# EAGLE design Tempus (EAGLE 7.7.0)
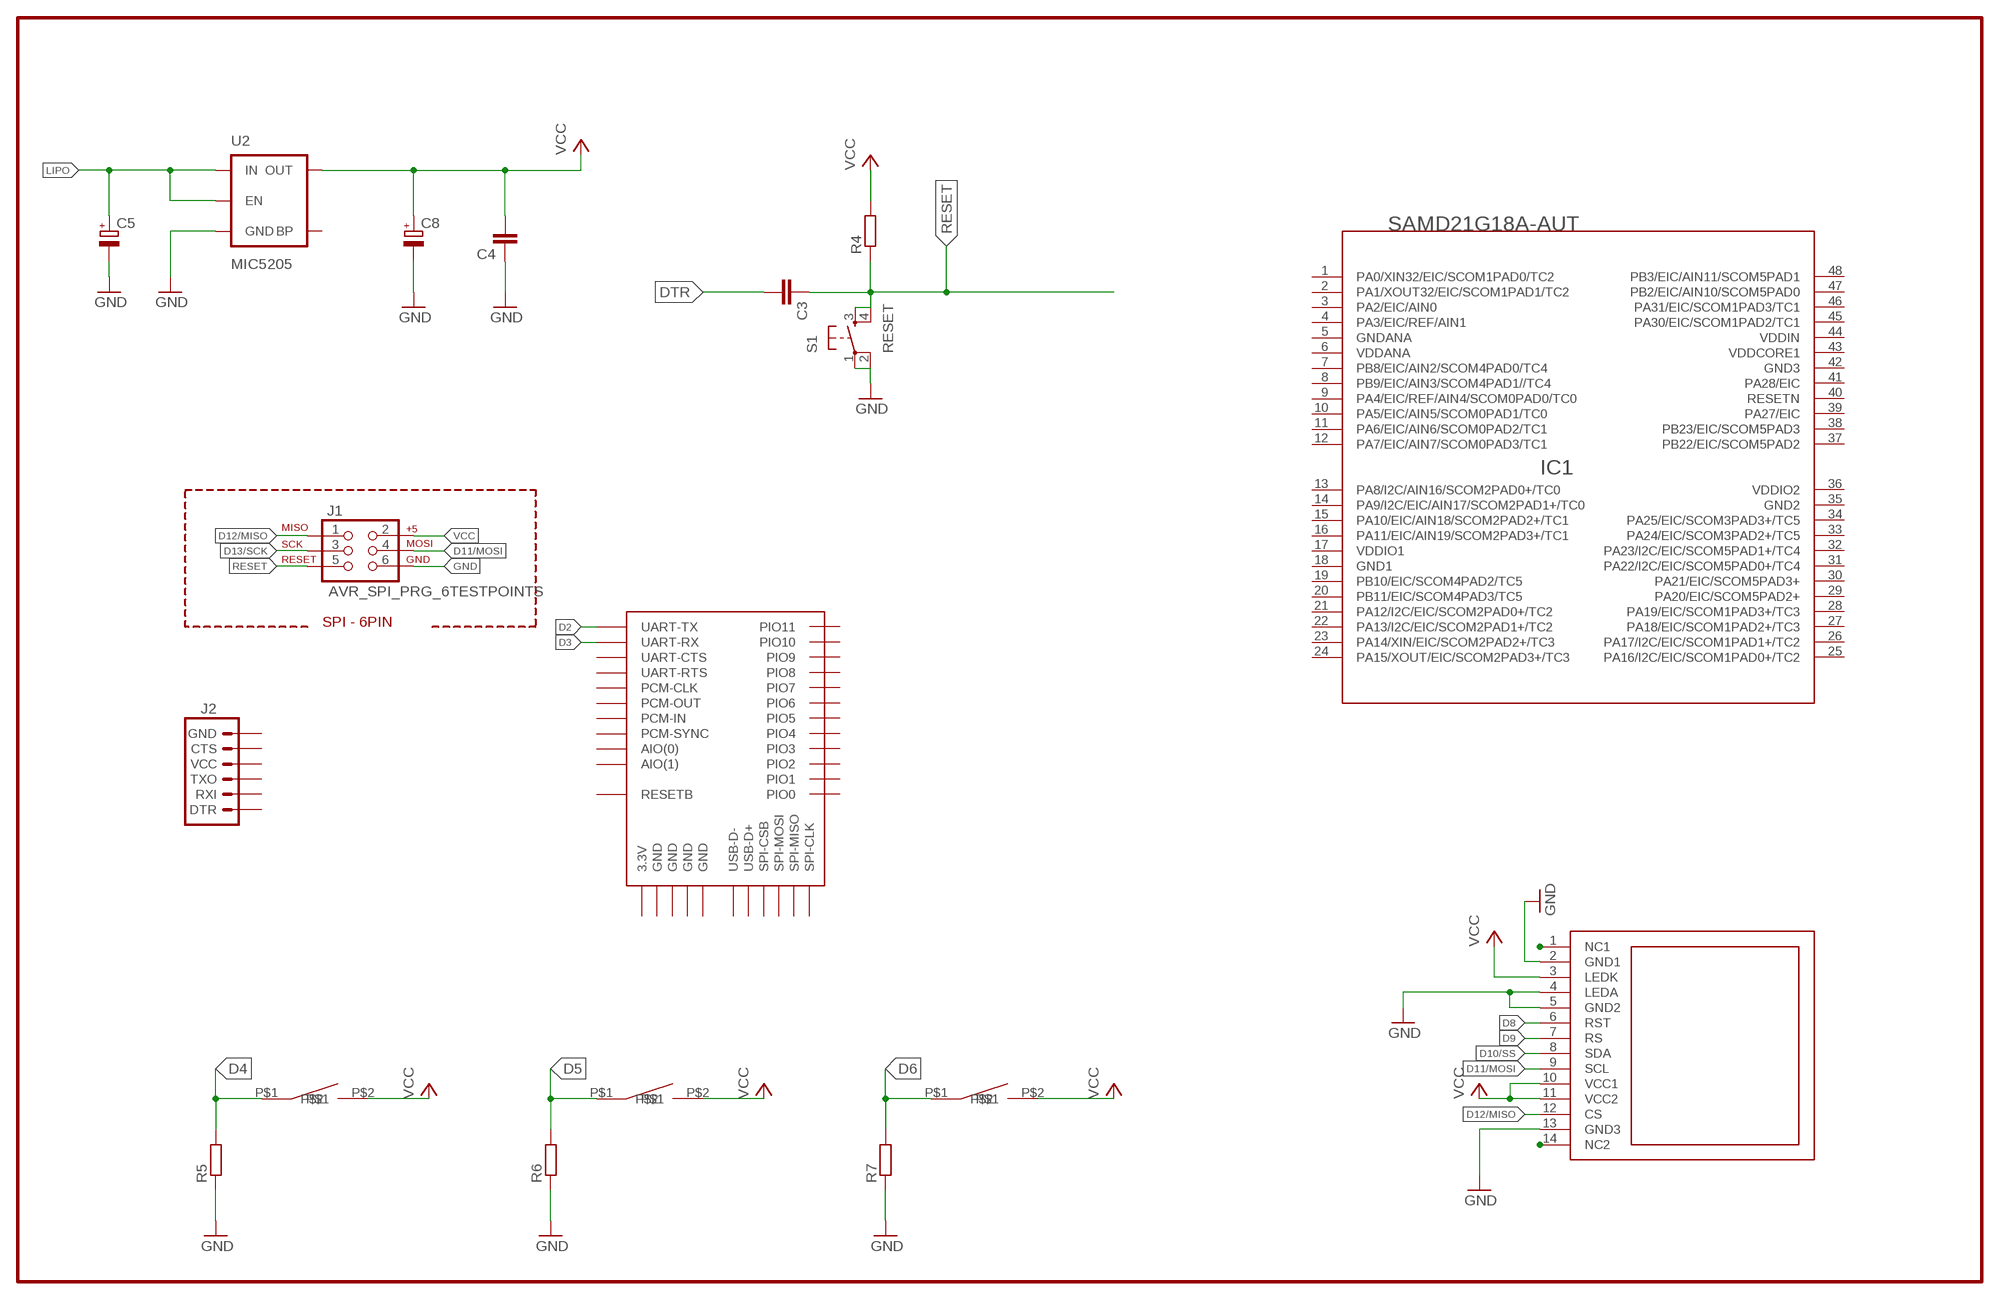
[diagram p0: schematic, sheet 1]

## Parts
C3  C-EUC1608  [C1608]
C4  C-EUC1608  [C1608]
C5  CPOL-EUA/3216-18R  [A/3216-18R]
C8  CPOL-EUA/3216-18R  [A/3216-18R]
IC1  SAMD21G18A-AUT  1792_SAMD21G18A-AUT  [TQFP48-7X7]
J1  AVR_SPI_PRG_6TESTPOINTS  [2X3_TEST_POINTS]
J2  ARDUINO_SERIAL_PROGRAMPTH  [1X06]
R4  R-EU_R0603  [R0603]
R5  R-EU_R0603  [R0603]
R6  R-EU_R0603  [R0603]
R7  R-EU_R0603  [R0603]
S1  RESET  TAC_SWITCHSMD  [TACTILE-SWITCH-SMD]
U2  MIC5205  MIC52055V  [SOT23-5]
U$1  DISP_TFT18  [TFT18]
U$2  MICRO_SIDE_TACT_BUTTON_SMD_SECURE  [MICRO_SIDE_TACT_BUTTON_SMD_SECURE]
U$3  MICRO_SIDE_TACT_BUTTON_SMD_SECURE  [MICRO_SIDE_TACT_BUTTON_SMD_SECURE]
U$4  MICRO_SIDE_TACT_BUTTON_SMD_SECURE  [MICRO_SIDE_TACT_BUTTON_SMD_SECURE]
U$5  BTM400_6B  [BTM400_6B]

## Nets
D2: U$5.UART-TX
D3: U$5.UART-RX
D4: R5.2 U$4.P$1
D5: R6.2 U$2.P$1
D6: R7.2 U$3.P$1
D8: U$1.6(RST)
D9: U$1.7(RS)
D10/SS: U$1.8(SDA)
D11/MOSI: J1.4 U$1.9(SCL)
D12/MISO: J1.1 U$1.12(CS)
D13/SCK: J1.3
DTR: C3.2
GND: C4.1 C5.- C8.- J1.6 R5.1 R6.1 R7.1 S1.1 S1.2 U2.2(GND) U$1.2(GND1) U$1.4(LEDA) U$1.5(GND2) U$1.13(GND3)
LIPO: C5.+ U2.1(IN) U2.3(EN)
N$11: U$1.1(NC1)
N$12: U$1.14(NC2)
RESET: C3.1 J1.5 R4.1 S1.3 S1.4
VCC: C4.2 C8.+ J1.2 R4.2 U2.5(OUT) U$1.3(LEDK) U$1.10(VCC1) U$1.11(VCC2) U$2.P$2 U$3.P$2 U$4.P$2
Unconnected: IC1.1(PA0/XIN32/EIC/SCOM1PAD0/TC2) IC1.2(PA1/XOUT32/EIC/SCOM1PAD1/TC2) IC1.3(PA2/EIC/AIN0) IC1.4(PA3/EIC/REF/AIN1) IC1.7(PB8/EIC/AIN2/SCOM4PAD0/TC4) IC1.8(PB9/EIC/AIN3/SCOM4PAD1//TC4) IC1.9(PA4/EIC/REF/AIN4/SCOM0PAD0/TC0) IC1.10(PA5/EIC/AIN5/SCOM0PAD1/TC0) IC1.11(PA6/EIC/AIN6/SCOM0PAD2/TC1) IC1.12(PA7/EIC/AIN7/SCOM0PAD3/TC1) IC1.13(PA8/I2C/AIN16/SCOM2PAD0+/TC0) IC1.14(PA9/I2C/EIC/AIN17/SCOM2PAD1+/TC0) IC1.15(PA10/EIC/AIN18/SCOM2PAD2+/TC1) IC1.16(PA11/EIC/AIN19/SCOM2PAD3+/TC1) IC1.19(PB10/EIC/SCOM4PAD2/TC5) IC1.20(PB11/EIC/SCOM4PAD3/TC5) IC1.21(PA12/I2C/EIC/SCOM2PAD0+/TC2) IC1.22(PA13/I2C/EIC/SCOM2PAD1+/TC2) IC1.23(PA14/XIN/EIC/SCOM2PAD2+/TC3) IC1.24(PA15/XOUT/EIC/SCOM2PAD3+/TC3) IC1.25(PA16/I2C/EIC/SCOM1PAD0+/TC2) IC1.26(PA17/I2C/EIC/SCOM1PAD1+/TC2) IC1.27(PA18/EIC/SCOM1PAD2+/TC3) IC1.28(PA19/EIC/SCOM1PAD3+/TC3) IC1.29(PA20/EIC/SCOM5PAD2+) IC1.30(PA21/EIC/SCOM5PAD3+) IC1.31(PA22/I2C/EIC/SCOM5PAD0+/TC4) IC1.32(PA23/I2C/EIC/SCOM5PAD1+/TC4) IC1.33(PA24/EIC/SCOM3PAD2+/TC5) IC1.34(PA25/EIC/SCOM3PAD3+/TC5) IC1.37(PB22/EIC/SCOM5PAD2) IC1.38(PB23/EIC/SCOM5PAD3) IC1.39(PA27/EIC) IC1.40(RESETN) IC1.41(PA28/EIC) IC1.43(VDDCORE1) IC1.45(PA30/EIC/SCOM1PAD2/TC1) IC1.46(PA31/EIC/SCOM1PAD3/TC1) IC1.47(PB2/EIC/AIN10/SCOM5PAD0) IC1.48(PB3/EIC/AIN11/SCOM5PAD1) J2.1(DTR) J2.2(RXI) J2.3(TXO) J2.4(VCC) J2.5(CTS) J2.6(GND) U2.4(BP) U$5.AIO(0) U$5.AIO(1) U$5.PCM-CLK U$5.PCM-IN U$5.PCM-OUT U$5.PCM-SYNC U$5.PIO(0)(PIO0) U$5.PIO(1)(PIO1) U$5.PIO(2)(PIO2) U$5.PIO(3)(PIO3) U$5.PIO(4)(PIO4) U$5.PIO(5)(PIO5) U$5.PIO(6)(PIO6) U$5.PIO(7)(PIO7) U$5.PIO(8)(PIO8) U$5.PIO(9)(PIO9) U$5.PIO(10)(PIO10) U$5.PIO(11)(PIO11) U$5.RESETB U$5.SPI-CLK U$5.SPI-CSB U$5.SPI-MISO U$5.SPI-MOSI U$5.UART-CTS U$5.UART-RTS U$5.USB-D+ U$5.USB-D-

## Notes on the sheet
- SPI - 6PIN

## Power pins joined to a net without a drawn wire
3.3V: U$5.3.3V
GND: U$5.GND@1(GND) U$5.GND@2(GND) U$5.GND@3(GND) U$5.GND@4(GND)
GND1: IC1.18(GND1)
GND2: IC1.35(GND2)
GND3: IC1.42(GND3)
GNDANA: IC1.5(GNDANA)
VDDANA: IC1.6(VDDANA)
VDDIN: IC1.44(VDDIN)
VDDIO1: IC1.17(VDDIO1)
VDDIO2: IC1.36(VDDIO2)

## Library data of the parts
C3 C4 = KarlVaello-Capacitors:C-EU: CAPACITOR, European symbol
C5 C8 = KarlVaello-Capacitors:CPOL-EU: POLARIZED CAPACITOR, European symbol
IC1 = KarlVaello-DigitalIC:1792_SAMD21G18A-AUT: Atmel D21 32bit ARM Cortex-M0 microcontroller - 48 PIN TQFP 256KB flash memory + 32KB SRAM
J1 = SparkFun-Connectors:AVR_SPI_PRG_6: AVR ISP 6 Pin This is the reduced ISP connector for AVR programming. Common on Arduino. This footprint will take up less PCB space and can be used with a 10-pin to 6-pin adapter such as SKU: BOB-08508 **Special note about "TEST_POINT" package. The stop mask is on the top side, so if you want your programming test points to be on the bottom of your board, make sure to place this package on the bottom side of the board. This also ensure that the orientation to program from the bottom side will be correct.
J2 = SparkFun-Connectors:ARDUINO_SERIAL_PROGRAM: FTDI connector footprints
R4-R7 = KarlVaello-Resistors:R-EU_: RESISTOR, European symbol
S1 = SparkFun-Retired:TAC_SWITCH: Momentary Switch Button commonly used for reset or general input. Spark Fun Electronics SKU : COM-00097 SMT- SWCH-08247; PROD_ID: SWCH-08247; VALUE: TAC_SWITCHSMD
U2 = SparkFun-PowerIC:MIC5205: MIC5205 150mA vreg 3.3V - VREG-00822 5V - VREG-00823; PROD_ID: VREG-00823
U$1 = KarlVaello-Displays:DISP_TFT18
U$2-U$4 = KarlVaello-ElectroMechanical:MICRO_SIDE_TACT_BUTTON_SMD_SECURE
U$5 = bc417:BTM400_6B

## Board
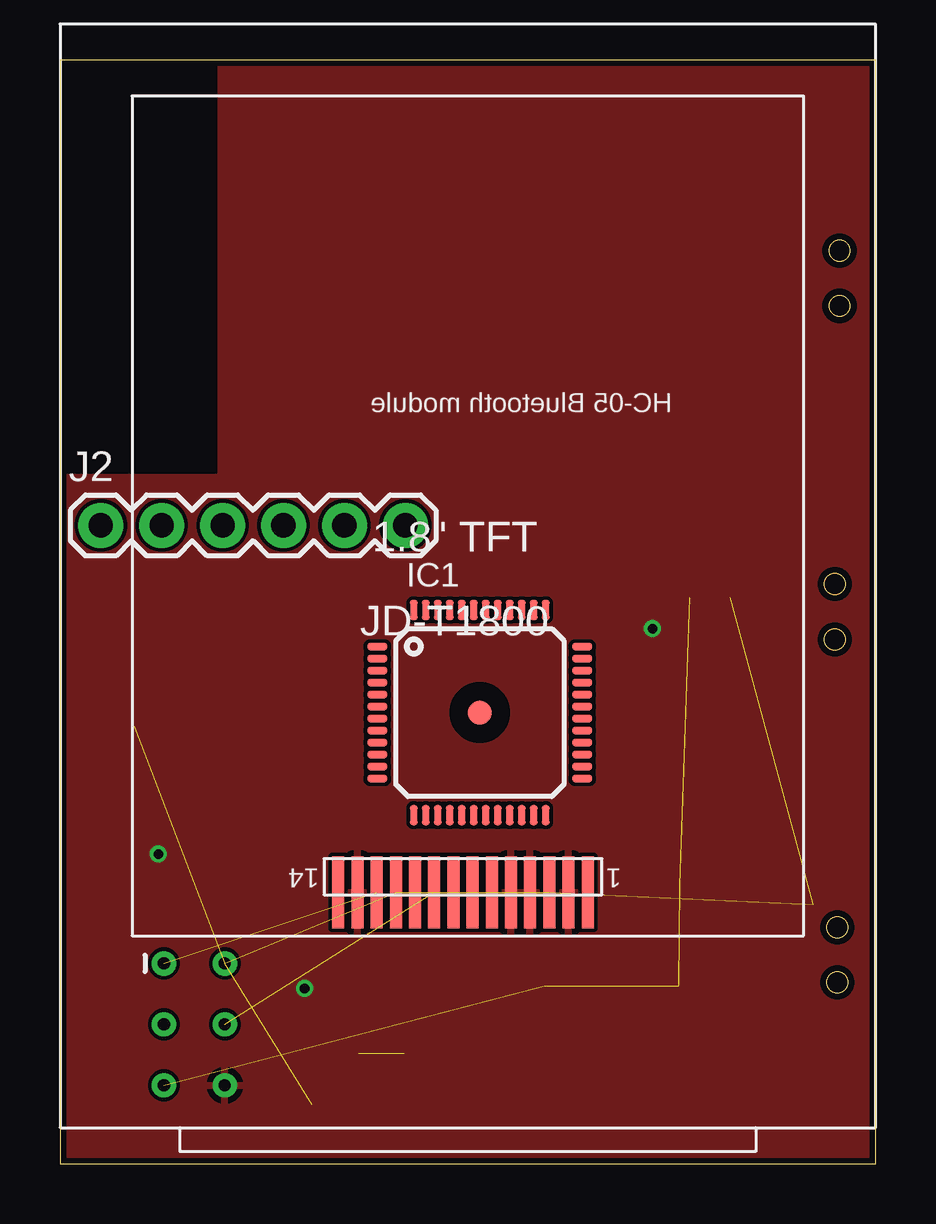
[diagram p1: board, top side]
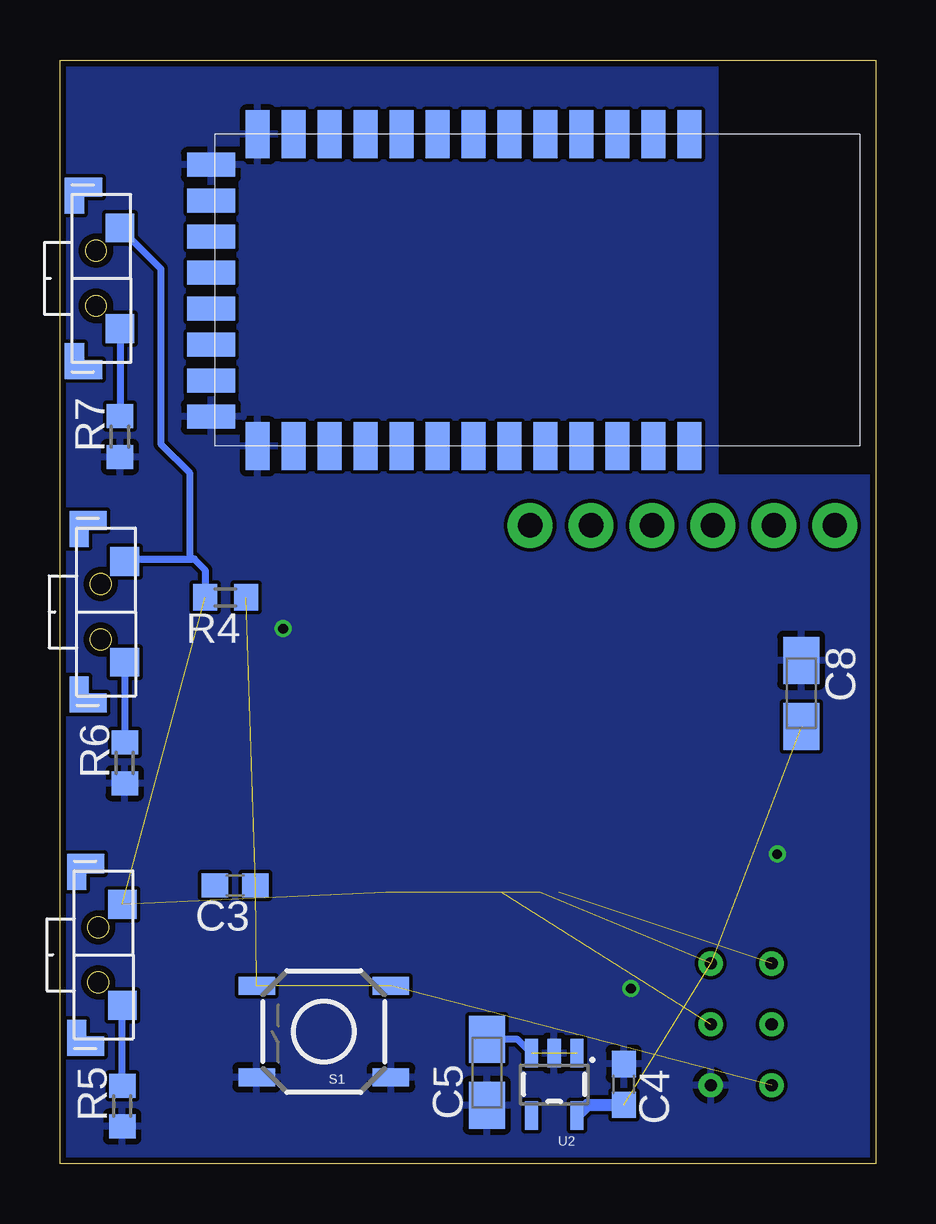
[diagram p2: board, bottom side, seen from below]

Size 34 x 46 mm. Coordinates in mm from the lower left corner, seen from the top.
Outline: 0,0 34,0 34,46 0,46 0,0
Copper layers (1*16): Top 0.035mm / dielectric 1.5mm / Bottom 0.035mm
Design rules "SeeedStudio_2layer_DRU_no_angle_20140221": minimum track width 6mil, minimum drill 12mil, track to track 6mil, track to pad 6mil, pad to pad 6mil, via to via 6mil, smd to smd 0mil, copper to edge 10mil, drill to drill 10mil, minimum pad ring 10mil, minimum via ring 6mil, stop-mask expansion 2mil, vias tented up to drill 100mil, thermal gap 10mil

### Footprints (pad centres in the part's own frame; a part is rotated, then mirrored left to right if it is on the bottom)
C1608 = smd 1.1 x 1: 1 -0.85,0; 2 0.85,0
A/3216-18R = smd 1.95 x 1.5: + 1.375,0; - -1.375,0
TQFP48-7X7 = smd 0.85 x 0.32: 1 -4.275,2.75; 2 -4.275,2.25; 3 -4.275,1.75; 4 -4.275,1.25; 5 -4.275,0.75; 6 -4.275,0.25; 7 -4.275,-0.25; 8 -4.275,-0.75; 9 -4.275,-1.25; 10 -4.275,-1.75; 11 -4.275,-2.25; 12 -4.275,-2.75; 25 4.275,-2.75; 26 4.275,-2.25; 27 4.275,-1.75; 28 4.275,-1.25; 29 4.275,-0.75; 30 4.275,-0.25; 31 4.275,0.25; 32 4.275,0.75; 33 4.275,1.25; 34 4.275,1.75; 35 4.275,2.25; 36 4.275,2.75 | smd 0.32 x 0.85: 13 -2.75,-4.275; 14 -2.25,-4.275; 15 -1.75,-4.275; 16 -1.25,-4.275; 17 -0.75,-4.275; 18 -0.25,-4.275; 19 0.25,-4.275; 20 0.75,-4.275; 21 1.25,-4.275; 22 1.75,-4.275; 23 2.25,-4.275; 24 2.75,-4.275; 37 2.75,4.275; 38 2.25,4.275; 39 1.75,4.275; 40 1.25,4.275; 41 0.75,4.275; 42 0.25,4.275; 43 -0.25,4.275; 44 -0.75,4.275; 45 -1.25,4.275; 46 -1.75,4.275; 47 -2.25,4.275; 48 -2.75,4.275 | smd 1 x 1: P$1 0,0
2X3_TEST_POINTS = drill 0.508: 1 -2.54,-1.27; 2 -2.54,1.27; 3 0,-1.27; 4 0,1.27; 5 2.54,-1.27; 6 2.54,1.27
1X06 = drill 1.016 pad 1.88: 1 0,0; 2 2.54,0; 3 5.08,0; 4 7.62,0; 5 10.16,0; 6 12.7,0
R0603 = smd 1 x 1.1: 1 -0.85,0; 2 0.85,0
TACTILE-SWITCH-SMD = smd 1.524 x 0.762: 1 -2.794,1.905; 2 2.794,1.905; 3 -2.794,-1.905; 4 2.794,-1.905
SOT23-5 = smd 0.55 x 1.2: 1 -0.95,-1.3; 2 0,-1.3; 3 0.95,-1.3; 4 0.95,1.3; 5 -0.95,1.3
TFT18 = smd 3 x 0.5: 1 13.2,5; 2 13.2,4.2; 3 13.2,3.4; 4 13.2,2.6; 5 13.2,1.8; 6 13.2,1; 7 13.2,0.2; 8 13.2,-0.6; 9 13.2,-1.4; 10 13.2,-2.2; 11 13.2,-3; 12 13.2,-3.8; 13 13.2,-4.6; 14 13.2,-5.4
MICRO_SIDE_TACT_BUTTON_SMD_SECURE = smd 1.2 x 1.2: P$1 -2.1,-1; P$2 2.1,-1 | smd 0.8 x 1.5: SH11 -3.8,0.5; SH21 3.8,0.5 | smd 1.5 x 0.8: SH12 -3.45,0.9; SH22 3.45,0.9
BTM400_6B = smd 2 x 1: 3.3V -6.5,-10.16; AIO(0) -6.5,-5.66; AIO(1) -6.5,-7.16; GND@1 -6.5,-11.66; GND@4 6.5,-11.66; PCM-CLK -6.5,0.34; PCM-IN -6.5,-2.66; PCM-OUT -6.5,-1.16; PCM-SYNC -6.5,-4.16; PIO(0) 6.5,-10.16; PIO(1) 6.5,-8.66; PIO(2) 6.5,-7.16; PIO(3) 6.5,-5.66; PIO(4) 6.5,-4.16; PIO(5) 6.5,-2.66; PIO(6) 6.5,-1.16; PIO(7) 6.5,0.34; PIO(8) 6.5,1.84; PIO(9) 6.5,3.34; PIO(10) 6.5,4.84; PIO(11) 6.5,6.34; RESETB -6.5,-8.66; UART-CTS -6.5,3.34; UART-RTS -6.5,1.84; UART-RX -6.5,4.84; UART-TX -6.5,6.34 | smd 1 x 2: GND@2 -5.23,-13.6; GND@3 5.27,-13.6; SPI-CLK 2.27,-13.6; SPI-CSB -2.23,-13.6; SPI-MISO 0.77,-13.6; SPI-MOSI -0.73,-13.6; USB-D+ 3.77,-13.6; USB-D- -3.73,-13.6

### Placement (x,y rotation side)
C3  26.7,11.6 180 bottom
C4  10.5,3.3 270 bottom
C5  16.2,3.8 90 bottom
C8  3.1,19.6 270 bottom
IC1  17.5,18.8 0 top
J1  5.6,5.8 270 top
J2  1.7,26.6 0 top
R4  27.1,23.6 180 bottom
R5  31.4,2.4 90 bottom
R6  31.3,16.7 90 bottom
R7  31.5,30.3 90 bottom
S1  23,5.5 180 bottom
U2  13.4,3.3 180 bottom
U$1  17,24.5 270 top
U$2  32.3,23 90 bottom
U$3  32.5,36.9 90 bottom
U$4  32.4,8.7 90 bottom
U$5  14.1,36.4 270 bottom

### Tracks (layer width: path | path; a pad name or v marks a point on that pad's centre or on a via)
D4
  Bottom 0.3: R5.2 U$4.P$1
D5
  Bottom 0.3: U$2.P$1 R6.2
D6
  Bottom 0.3: U$3.P$1 R7.2
D11/MOSI  (1 unrouted)
D12/MISO  (1 unrouted)
GND  (via drill 0.4)
  other vias: 4.1,12.9 10.2,7.3 24.7,22.3
  pour Bottom: -3.8,-4.4 39,-4.4 39,52.4 6.7,52.4 6.7,28.6 -3.7,28.6
  pour Top: -2,-2.8 37,-2.8 37,49.3 6.7,49.2 6.7,28.6 -1.9,28.6
LIPO  (1 unrouted)
  Bottom 0.3: U2.3 14.93,5.17 C5.+
RESET  (4 unrouted)
VCC  (7 unrouted)
  Bottom 0.3: U$2.P$2 31.2,25.2 28.6,25.2 | 28.6,25.2 28.4,25.2 27.95,24.75 R4.2 | U$3.P$2 29.8,37.3 29.8,30 28.6,28.8 28.6,25.2
  Bottom 0.5: U2.5 12,2.45 C4.2